# Altium schematic sheet Block Diagram.SchDoc: Block Diagram Schematic
size A3; ApprovedBy: Betül Demirhan; CheckedBy: UDEMY; DrawnBy: Furkan Demirhan; Revision: 01; SheetNumber: 2; SheetTotal: 5; ENG_APP_DATE: --/--/--; DSN_APP_DATE: --/--/--; CHK_APP_DATE: --/--/--; ProjectDescription: Wireless Security Detector; ReleaseDate: 27.07.2024
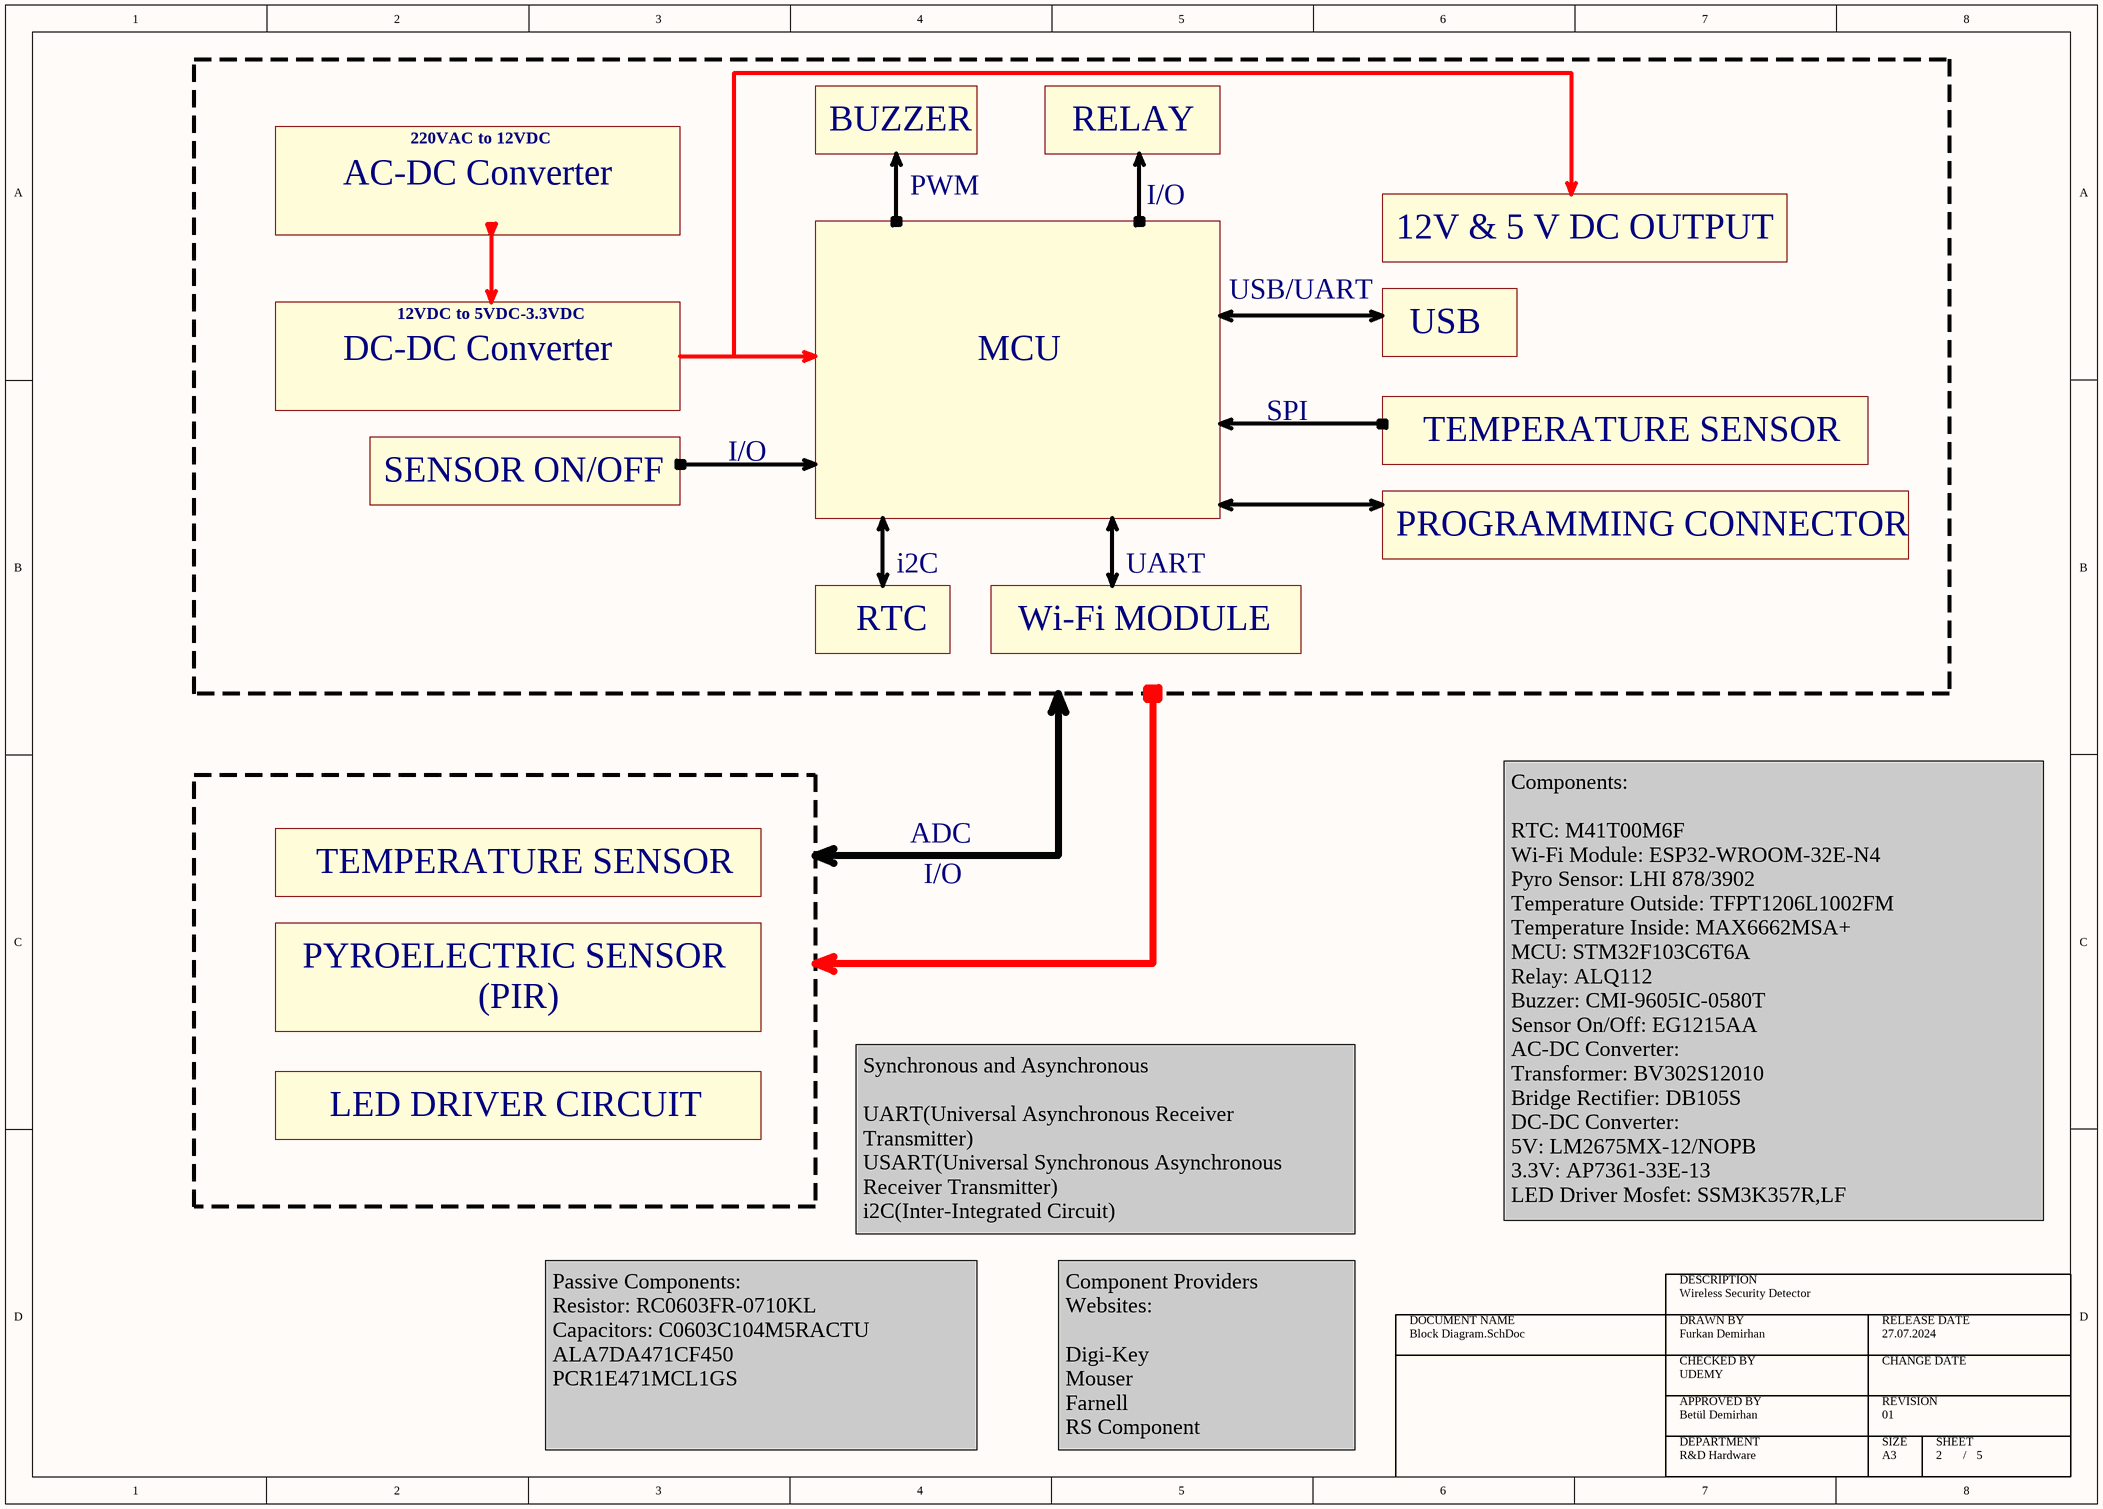
[diagram p0: Block Diagram.SchDoc]

## Notes on the sheet
- 220VAC to 12VDC
- BUZZER
- PWM
- RELAY
- AC-DC Converter
- I/O
- 12V & 5 V DC OUTPUT
- 12VDC to 5VDC-3.3VDC
- USB/UART
- DC-DC Converter
- MCU
- USB
- SPI
- TEMPERATURE SENSOR
- SENSOR ON/OFF
- i2C
- UART
- PROGRAMMING CONNECTOR
- RTC
- Wi-Fi MODULE
- ADC
- PYROELECTRIC SENSOR
- (PIR)
- LED DRIVER CIRCUIT
- Synchronous and Asynchronous
  UART(Universal Asynchronous Receiver Transmitter)
  USART(Universal Synchronous Asynchronous Receiver Transmitter)
  i2C(Inter-Integrated Circuit)
  SPI(Serial Peripheral Interface)
- Components:
  RTC: M41T00M6F
  Wi-Fi Module: ESP32-WROOM-32E-N4
  Pyro Sensor: LHI 878/3902
  Temperature Outside: TFPT1206L1002FM
  Temperature Inside: MAX6662MSA+
  MCU: STM32F103C6T6A
  Relay: ALQ112
  Buzzer: CMI-9605IC-0580T
  Sensor On/Off: EG1215AA
  AC-DC Converter:
  Transformer: BV302S12010
  Bridge Rectifier: DB105S
  DC-DC Converter:
  5V: LM2675MX-12/NOPB
  3.3V: AP7361-33E-13
  LED Driver Mosfet: SSM3K357R,LF
- Passive Components:
  Resistor: RC0603FR-0710KL
  Capacitors: C0603C104M5RACTU
  ALA7DA471CF450
  PCR1E471MCL1GS
- Component Providers Websites:
  Digi-Key
  Mouser
  Farnell
  RS Component
  LCSC
- DOCUMENT NAME
- DESCRIPTION
- DRAWN BY
- RELEASE DATE
- CHECKED BY
- CHANGE DATE
- APPROVED BY
- DEPARTMENT
- R&D Hardware
- SIZE
- A3
- REVISION
- SHEET
- /